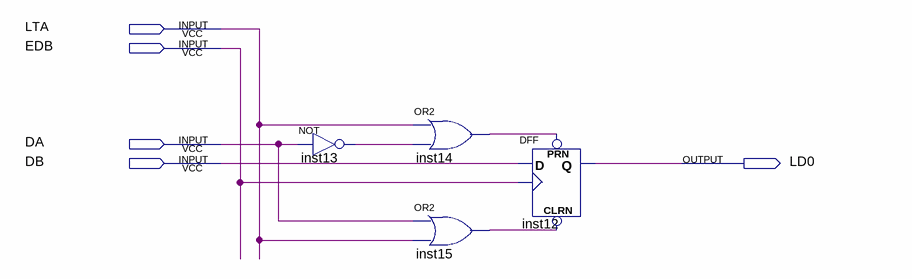
[diagram p0: schematic sheet]
// Quartus schematic 2buferlatchedge1b.bdf as structural Verilog: 4 symbols, 5 pins
module \2buferlatchedge1b  (
  input  LTA,
  input  EDB,
  input  DA,
  input  DB,
  output LD0
);

  wire inst13_out, inst14_out, inst15_out;

  not inst13 (inst13_out, DA);
  or inst14 (inst14_out, LTA, inst13_out);
  or inst15 (inst15_out, DA, LTA);
  DFF inst12 (.CLRN(inst15_out), .CLK(EDB), .D(DB), .PRN(inst14_out), .Q(LD0));
endmodule
